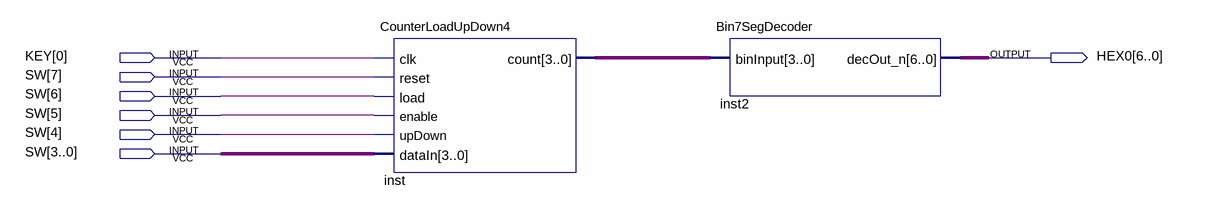
[diagram p0: schematic sheet]
// Quartus schematic Counter_Demo.bdf as structural Verilog: 2 symbols, 7 pins
module Counter_Demo (
  input  [0:0] KEY,
  input  [7:0] SW,
  output [6:0] HEX0
);

  wire [3:0] inst_count;

  CounterLoadUpDown4 inst (
    .clk(KEY[0]), .reset(SW[7]), .load(SW[6]), .enable(SW[5]), .upDown(SW[4]), .dataIn(SW[3:0]),
    .count(inst_count));
  Bin7SegDecoder inst2 (.binInput(inst_count), .decOut_n(HEX0));
endmodule
